# EAGLE design ob-xa-2p-lpf (EAGLE 9.5.1)
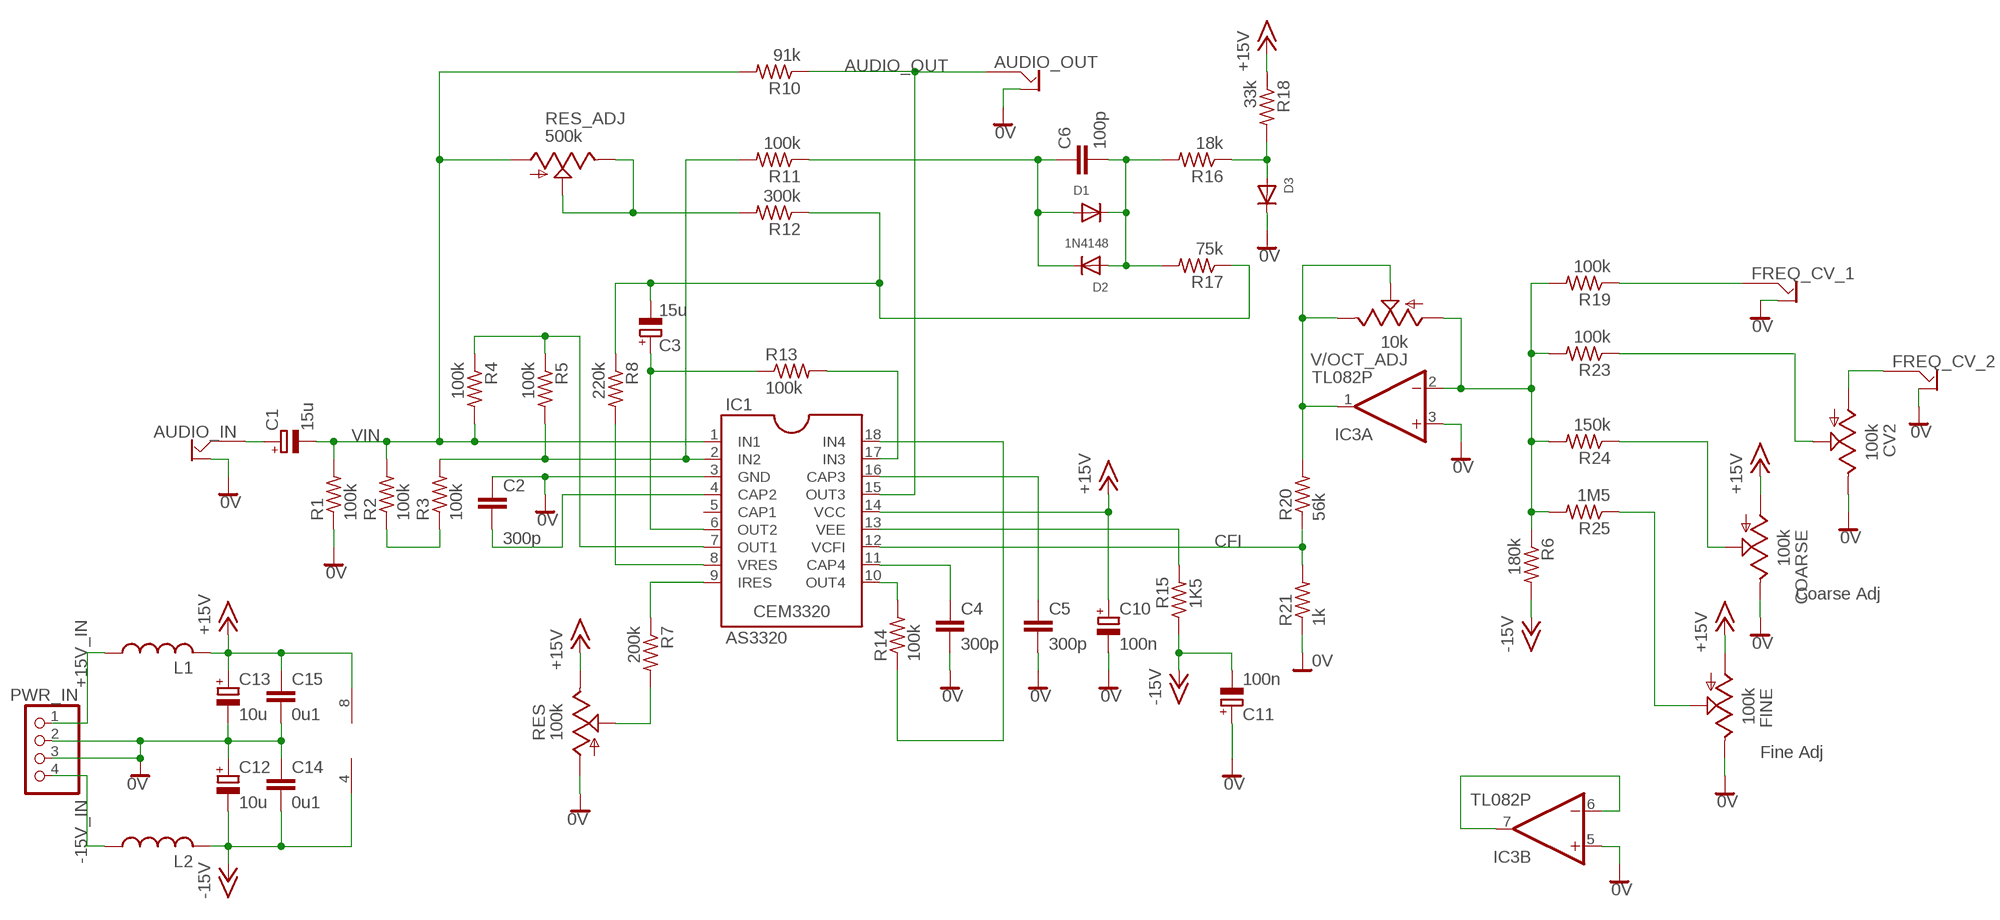
[diagram p0: schematic, sheet 1]

## Parts
AUDIO_IN  OFFBOARD2JACKALT  [OFFBOARD2JACKALT]
AUDIO_OUT  OFFBOARD2JACKALT  [OFFBOARD2JACKALT]
C1  15u  CPOL-EUE1.8-4  [E1,8-4]
C2  300p  C-EU050-025X075  [C050-025X075]
C3  15u  CPOL-EUE1.8-4  [E1,8-4]
C4  300p  C-EU050-025X075  [C050-025X075]
C5  300p  C-EU050-025X075  [C050-025X075]
C6  100p  C-EU050-025X075  [C050-025X075]
C10  100n  CPOL-EUE1.8-4  [E1,8-4]
C11  100n  CPOL-EUE1.8-4  [E1,8-4]
C12  10u  CPOL-EUE1.8-4  [E1,8-4]
C13  10u  CPOL-EUE1.8-4  [E1,8-4]
C14  0u1  C-EU050-025X075  [C050-025X075]
C15  0u1  C-EU050-025X075  [C050-025X075]
COARSE  100k  TRIM_US-B64Y  [B64Y]
CV2  100k  TRIM_US-B64Y  [B64Y]
D1  1N4148  DIODEDO-1N4148  [DO-1N4148]
D2  1N4148  DIODEDO-1N4148  [DO-1N4148]
D3  1N4148  DIODEDO-1N4148  [DO-1N4148]
FINE  100k  TRIM_US-B64Y  [B64Y]
FREQ_CV_1  OFFBOARD2JACKALT  [OFFBOARD2JACKALT]
FREQ_CV_2  OFFBOARD2JACKALT  [OFFBOARD2JACKALT]
IC1  AS3320  [DIL18]
IC3  TL082P  [DIL08]
L1  L-US0207/10  [0207/10]
L2  L-US0207/10  [0207/10]
PWR_IN  PINHD-1X4  [1X04]
R1  100k  R-US_0207/10  [0207/10]
R2  100k  R-US_0207/10  [0207/10]
R3  100k  R-US_0207/10  [0207/10]
R4  100k  R-US_0207/10  [0207/10]
R5  100k  R-US_0207/10  [0207/10]
R6  180k  R-US_0207/10  [0207/10]
R7  200k  R-US_0207/10  [0207/10]
R8  220k  R-US_0207/10  [0207/10]
R10  91k  R-US_0207/10  [0207/10]
R11  100k  R-US_0207/10  [0207/10]
R12  300k  R-US_0207/10  [0207/10]
R13  100k  R-US_0207/10  [0207/10]
R14  100k  R-US_0207/10  [0207/10]
R15  1K5  R-US_0207/10  [0207/10]
R16  18k  R-US_0207/10  [0207/10]
R17  75k  R-US_0207/10  [0207/10]
R18  33k  R-US_0207/10  [0207/10]
R19  100k  R-US_0207/10  [0207/10]
R20  56k  R-US_0207/10  [0207/10]
R21  1k  R-US_0207/10  [0207/10]
R23  100k  R-US_0207/10  [0207/10]
R24  150k  R-US_0207/10  [0207/10]
R25  1M5  R-US_0207/10  [0207/10]
RES  100k  TRIM_US-B64Y  [B64Y]
RES_ADJ  500k  TRIM_US-S63P  [S63P]
V/OCT_ADJ  10k  TRIM_US-S63P  [S63P]

## Nets
0V [Power]: AUDIO_IN.GND AUDIO_OUT.GND C2.1 C4.2 C5.2 C10.- C11.+ C12.+ C13.- C14.1 C15.2 COARSE.E CV2.E D3.C FINE.E FREQ_CV_1.GND FREQ_CV_2.GND IC1.3(GND) IC3.3(A:+IN) IC3.5(B:+IN) PWR_IN.2 PWR_IN.3 R1.1 R21.1 RES.A
+15V [Power]: C10.+ C13.+ C15.1 COARSE.A FINE.A IC1.14(VCC) IC3.8(P:V+) L1.2 R18.1 RES.E
+15V_IN [Power]: L1.1 PWR_IN.1
-15V [Power]: C11.- C12.- C14.2 IC3.4(P:V-) L2.2 R6.2 R15.1
-15V_IN [Power]: L2.1 PWR_IN.4
AUDIO_IN: AUDIO_IN.SIGNAL C1.+
AUDIO_OUT: AUDIO_OUT.SIGNAL IC1.15(OUT3) R10.1
CFI: IC1.12(VCFI) R20.1 R21.2
N$1: R2.1 R3.1
N$2: IC3.1(A:OUT) R20.2 V/OCT_ADJ.E V/OCT_ADJ.S
N$3: IC1.2(IN2) R3.2 R5.2 R11.2
N$4: C2.2 IC1.4(CAP2)
N$5: IC1.7(OUT1) R4.1 R5.1
N$6: C3.+ IC1.6(OUT2) R13.1
N$7: C6.1 D1.A D2.C R11.1
N$8: C6.2 D1.C D2.A R16.2 R17.2
N$9: D3.A R16.1 R18.2
N$10: IC1.17(IN3) R13.2
N$11: IC1.10(OUT4) R14.2
N$12: IC1.18(IN4) R14.1
N$13: IC1.8(VRES) R8.2
N$14: C3.- R8.1 R12.1 R17.1
N$15: R12.2 RES_ADJ.E RES_ADJ.S
N$16: IC1.13(VEE) R15.2
N$17: IC1.9(IRES) R7.1
N$18: C4.1 IC1.11(CAP4)
N$19: R7.2 RES.S
N$20: C5.1 IC1.16(CAP3)
N$22: IC3.6(B:-IN) IC3.7(B:OUT)
N$23: IC3.2(A:-IN) R6.1 R19.2 R23.2 R24.2 R25.2 V/OCT_ADJ.A
N$24: FREQ_CV_1.SIGNAL R19.1
N$25: CV2.S R23.1
N$26: CV2.A FREQ_CV_2.SIGNAL
N$27: COARSE.S R24.1
N$28: FINE.S R25.1
VIN: C1.- IC1.1(IN1) R1.2 R2.2 R4.2 R10.2 RES_ADJ.A
Unconnected: IC1.5(CAP1)

## Notes on the sheet
- Coarse Adj
- Fine Adj

## Library data of the parts
AUDIO_IN AUDIO_OUT FREQ_CV_1 FREQ_CV_2 = aarons_library:OFFBOARD2JACKALT
C1 C3 C10-C13 = rcl:CPOL-EU: POLARIZED CAPACITOR, European symbol; SPICEPREFIX: C
C2 C4-C6 C14 C15 = rcl:C-EU: CAPACITOR, European symbol; SPICEPREFIX: C
COARSE CV2 FINE RES RES_ADJ V/OCT_ADJ = pot:TRIM_US-: POTENTIOMETER
D1-D3 = adafruit:DIODE: Diode SMADIODE - SMA Surface Mount Package 20V 1A Schottky Diode Digikey: 641-1014-6-ND DO-1N4148 - Through Hole Small Current Diode SOD-123 20V 1 A (.5mV Vf) Schottky Diode - Digikey: MBRX120TPMSCT-ND SOD-323 10V 570mA (.38mV Vf, 3ns) Schottky Diode - Digikey: ZLLS410CT-ND SOD-523 30V 30mA Schottky Diode (RB751S-40TE61) - Digikey: RB751S-40TE61CT-ND SOT23-R/W - SOT23 Package (R = Solder Paste/Reflow Ovens, W = Hand-Soldering) BAT54Film 40V 300mA - Digikey: 497-7162-1-ND
IC1 = analog_audio:AS3320
IC3 = linear:TL082: OP AMP Data sheet <http://www.ti.com/lit/ds/symlink/tl084a . pdf>; DATA_SHEET: <a href="http://www.ti.com/lit/ds/symlink/tl084a.pdf"> Data sheet </a>
L1 L2 = rcl:L-US: INDUCTOR, American symbol; SPICEPREFIX: L
PWR_IN = pinhead:PINHD-1X4: PIN HEADER
R1-R8 R10-R21 R23-R25 = rcl:R-US_: RESISTOR, American symbol; SPICEPREFIX: R

## Net classes
0 default: width 0.406 mm
1 Power: width 0.762 mm

## Board
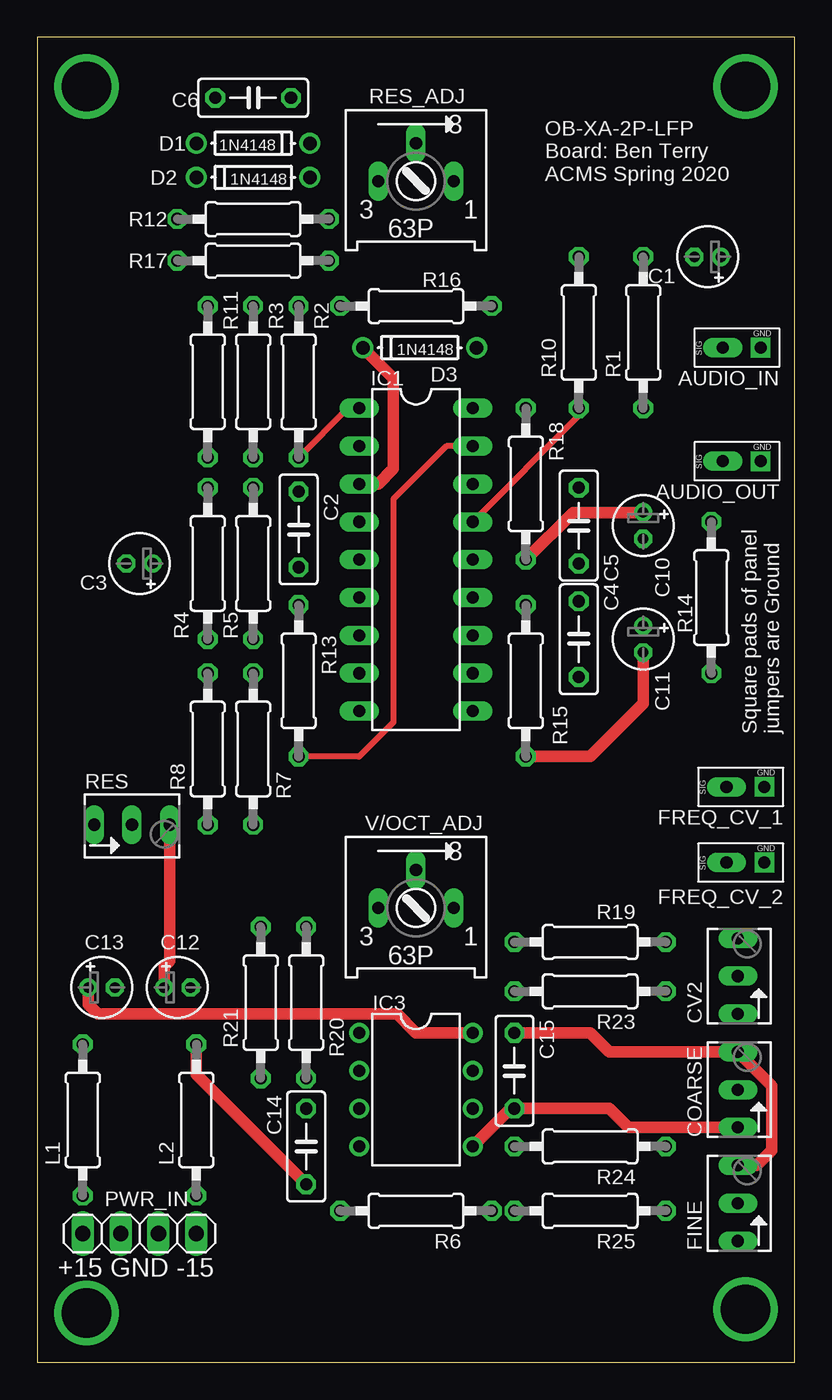
[diagram p1: board, top side]
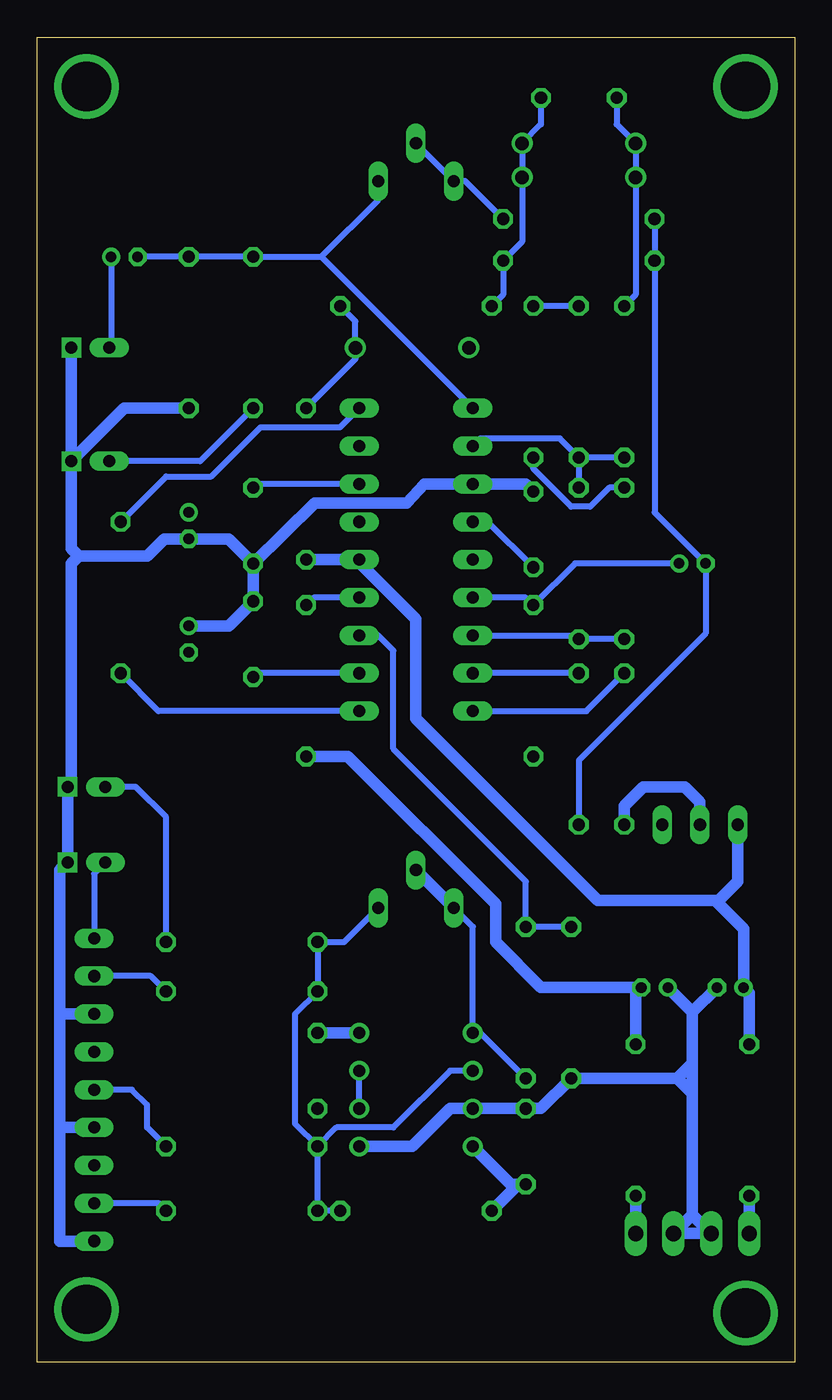
[diagram p2: board, bottom side, seen from below]

Size 50.8 x 88.9 mm. Coordinates in mm from the lower left corner, seen from the top.
Outline: 0,0 50.8,0 50.8,88.9 0,88.9 0,0
Copper layers (1*16): Top 0.035mm / dielectric 1.5mm / Bottom 0.035mm
Design rules "default": minimum track width 6mil, minimum drill 0.35mm, track to track 6mil, track to pad 6mil, pad to pad 6mil, via to via 6mil, smd to smd 6mil, copper to edge 40mil, drill to drill 6mil, minimum pad ring 10mil, minimum via ring 8mil, stop-mask expansion 4mil, vias tented up to drill 0mil, thermal gap 10mil

### Footprints (pad centres in the part's own frame; a part is rotated, then mirrored left to right if it is on the bottom)
OFFBOARD2JACKALT = drill 0.813 square: GND -1.27,-1.27 | drill 0.813 long: SIGNAL -1.27,1.27
E1,8-4 = drill 0.711 pad 1.168: + -0.889,0 | drill 0.711 pad 1.168 octagon: - 0.889,0
C050-025X075 = drill 0.813 octagon: 1 -2.54,0; 2 2.54,0
B64Y = drill 0.813 long: A 2.54,0; E -2.54,0; S 0,0
DO-1N4148 = drill 0.9: A -3.81,0; C 3.81,0
DIL18 = drill 0.813 long: 1 -10.16,-3.81; 2 -7.62,-3.81; 3 -5.08,-3.81; 4 -2.54,-3.81; 5 0,-3.81; 6 2.54,-3.81; 7 5.08,-3.81; 8 7.62,-3.81; 9 10.16,-3.81; 10 10.16,3.81; 11 7.62,3.81; 12 5.08,3.81; 13 2.54,3.81; 14 0,3.81; 15 -2.54,3.81; 16 -5.08,3.81; 17 -7.62,3.81; 18 -10.16,3.81
DIL08 = drill 0.813 pad 1.27: 1 -3.81,-3.81; 2 -1.27,-3.81; 3 1.27,-3.81; 4 3.81,-3.81; 5 3.81,3.81; 6 1.27,3.81; 7 -1.27,3.81; 8 -3.81,3.81
0207/10 = drill 0.813 octagon: 1 -5.08,0; 2 5.08,0
1X04 = drill 1.016 long: 1 -3.81,0; 2 -1.27,0; 3 1.27,0; 4 3.81,0
S63P = drill 0.813 long: A 2.54,0; E -2.54,0; S 0,2.54

### Placement (x,y rotation side)
AUDIO_IN  47.24,69.34 90 top
AUDIO_OUT  47.24,61.72 90 top
C1  44.96,74.17 180 top
C2  17.53,55.88 270 top
C3  6.86,53.59 180 top
C4  36.32,48.51 90 top
C5  36.32,56.13 270 top
C6  14.48,84.84 0 top
C10  40.64,56.13 270 top
C11  40.64,48.51 270 top
C12  9.4,25.15 0 top
C13  4.32,25.15 0 top
C14  18.03,14.48 270 top
C15  32,19.56 270 top
COARSE  46.99,18.29 90 top
CV2  46.99,25.91 90 top
D1  14.48,81.79 0 top
D2  14.48,79.5 180 top
D3  25.65,68.07 180 top
FINE  46.99,10.67 90 top
FREQ_CV_1  47.5,39.88 90 top
FREQ_CV_2  47.5,34.8 90 top
IC1  25.4,53.85 270 top
IC3  25.4,18.29 270 top
L1  3.05,16.26 90 top
L2  10.67,16.26 90 top
PWR_IN  6.86,8.64 0 top
R1  40.64,69.09 90 top
R2  17.53,65.79 270 top
R3  14.48,65.79 270 top
R4  11.43,53.59 90 top
R5  14.48,53.59 90 top
R6  25.4,10.16 180 top
R7  11.43,41.15 270 top
R8  14.48,41.15 90 top
R10  36.32,69.09 90 top
R11  11.43,65.79 270 top
R12  14.48,76.71 0 top
R13  17.53,45.72 270 top
R14  45.21,51.31 270 top
R15  32.77,45.72 90 top
R16  25.4,70.87 180 top
R17  14.48,73.91 0 top
R18  32.77,58.93 90 top
R19  37.08,28.19 180 top
R20  18.03,24.13 270 top
R21  14.99,24.13 90 top
R23  37.08,24.89 180 top
R24  37.08,14.48 180 top
R25  37.08,10.16 180 top
RES  6.35,36.07 0 top
RES_ADJ  25.4,79.25 0 top
V/OCT_ADJ  25.4,30.48 0 top

### Tracks (layer width: path | path; a pad name or v marks a point on that pad's centre or on a via)
0V
  Top 0.762: IC3.5 31.75,17.02 C15.2 38.35,17.02 39.62,15.75 COARSE.E | D3.C 23.88,66.04 23.88,59.94 22.86,58.93 IC1.3 | C12.+ 8.51,26.54 8.89,26.92 RES.A
  Bottom 0.762: C2.1 18.03,58.93 IC1.3 24.83,58.93 26.02,57.66 32.18,57.66 C5.2 | IC3.5 25.65,14.48 23.11,17.02 IC3.3 C14.1 17.02,17.02 R21.1 7.87,19.05 | C5.2 C4.2 37.97,49.4 C11.+ | C5.2 37.97,55.24 C10.- 42.29,55.24 43.43,54.1 48.01,54.1 | 49.28,23.37 49.28,33.02 FREQ_CV_2.GND FREQ_CV_1.GND 48.51,38.86 48.51,53.59 48.01,54.1 | 49.28,23.37 CV2.E | 49.28,23.37 49.28,15.75 | 49.28,15.75 COARSE.E | 49.28,15.75 49.28,8.13 FINE.E | AUDIO_OUT.GND AUDIO_IN.GND | R1.1 44.96,64.01 AUDIO_OUT.GND | AUDIO_OUT.GND 48.51,54.61 48.01,54.1 | 6.86,9.91 PWR_IN.3 PWR_IN.2 6.86,9.91 | C13.- 6.86,23.5 | 6.86,23.5 6.86,20.07 | 6.86,20.07 6.86,18.03 | 6.86,18.03 6.86,9.91 | C12.+ 6.86,23.5 | 7.87,19.05 6.86,18.03 | 7.87,19.05 6.86,20.07
+15V
  Top 0.762: C15.1 37.08,22.1 38.35,20.83 COARSE.A 49.28,18.54 49.28,14.22 48.26,13.21 FINE.A | R18.1 35.94,57.02 C10.+ | IC3.8 25.4,22.1 24.13,23.37 4.06,23.37 3.43,24 C13.+
  Bottom 0.762: R18.1 IC1.14 29.21,53.66 25.43,49.87 25.43,43.2 13.21,30.99 5.33,30.99 | IC3.8 C15.1 | L1.2 3.05,24.77 C13.+ 3.43,29.08 5.33,30.99 | 5.33,30.99 5.08,30.99 3.81,32.26 RES.E
+15V_IN
  Bottom 0.762: PWR_IN.1 L1.1
-15V
  Top 0.762: L2.2 10.67,19.3 C14.2 | R15.1 37.08,40.64 40.64,44.2 C11.-
  Bottom 0.762: IC3.4 19.05,11.94 C14.2 18.54,11.94 R6.2 | L2.2 10.67,24.77 C12.- 17.02,25.15 20.07,28.19 20.07,30.73 29.97,40.64 R15.1
-15V_IN
  Bottom 0.762: PWR_IN.4 L2.1
AUDIO_IN
  Bottom 0.406: C1.+ 45.85,68.2 AUDIO_IN.SIGNAL
AUDIO_OUT
  Top 0.406: IC1.15 36.32,63.5 R10.1
  Bottom 0.406: R10.1 39.88,60.45 AUDIO_OUT.SIGNAL
CFI
  Bottom 0.406: R21.2 R20.1 18.03,32.26 26.92,41.15 26.92,47.75 27.94,48.77 IC1.12
N$1
  Bottom 0.406: R3.1 R2.1
N$2
  Bottom 0.406: R20.2 21.08,22.1 IC3.1 21.59,29.21 V/OCT_ADJ.E
  Bottom 0.762: V/OCT_ADJ.E V/OCT_ADJ.S
N$3
  Bottom 0.406: R11.2 R3.2 | R3.2 R5.2 | R3.2 15.75,61.98 21.08,61.98 IC1.2
N$4
  Bottom 0.406: C2.2 20.57,56.39 IC1.4
N$5
  Bottom 0.406: R4.1 14.22,48.51 | 14.22,48.51 R5.1 | 14.22,48.51 14.48,48.77 IC1.7
N$6
  Bottom 0.406: C3.+ 14.73,53.59 R13.1 18.03,51.31 IC1.6
N$7
  Bottom 0.406: C6.1 11.94,83.06 D1.A D2.C 10.67,71.63 R11.1
N$8
  Bottom 0.406: C6.2 17.02,83.06 D1.C D2.A 18.29,75.18 R17.2 19.56,71.63 R16.2
N$9
  Bottom 0.406: R16.1 29.46,69.85 D3.A 29.46,67.31 R18.2
N$10
  Top 0.406: IC1.17 27.43,61.47 23.88,57.91 23.88,42.93 21.59,40.64 R13.2
N$11
  Bottom 0.406: IC1.10 42.67,43.69 R14.2
N$12
  Bottom 0.406: R14.1 42.16,59.44 39.12,59.44 35.81,62.74 30.48,62.74 IC1.18
N$13
  Bottom 0.406: R8.2 IC1.8
N$14
  Bottom 0.406: R12.1 R17.1 9.4,57.02 C3.- 5.97,48.9 14.48,40.39 R8.1
N$15
  Bottom 0.406: R12.2 22.1,79.25 RES_ADJ.E RES_ADJ.S
N$16
  Bottom 0.406: IC1.13 32.26,51.31 R15.2
N$17
  Bottom 0.406: IC1.9 13.97,43.69 R7.1
N$18
  Bottom 0.406: IC1.11 36.07,46.23 C4.1
N$19
  Bottom 0.762: RES.S 6.35,37.59 7.37,38.61 10.16,38.61 11.43,37.34 R7.2
N$20
  Bottom 0.406: IC1.16 36.07,58.93 C5.1
N$21  (via drill 3.3)
  other vias: 3.3,85.6
N$22
  Bottom 0.406: IC3.6 IC3.7
N$23
  Bottom 0.406: R6.1 R25.2 R24.2 | IC3.2 23.11,19.56 26.92,15.75 30.73,15.75 R24.2 | V/OCT_ADJ.A 30.23,28.19 R19.2 R23.2 33.53,23.37 33.53,16 R24.2
N$24
  Bottom 0.406: FREQ_CV_1.SIGNAL 44.2,38.61 42.16,36.58 R19.1
N$25
  Bottom 0.406: R23.1 43.18,25.91 CV2.S
N$26
  Bottom 0.406: FREQ_CV_2.SIGNAL 46.99,32.77 CV2.A
N$27
  Bottom 0.406: R24.1 43.43,15.75 43.43,17.27 44.45,18.29 COARSE.S
N$28
  Bottom 0.406: R25.1 42.67,10.67 FINE.S
N$29  (via drill 3.3)
  other vias: 47.5,85.6
N$30  (via drill 3.3)
  other vias: 47.5,3.56
N$31  (via drill 3.3)
  other vias: 3.3,3.3
VIN
  Top 0.406: R2.2 20.83,64.01 IC1.1
  Bottom 0.406: R4.2 12.45,58.67 13.72,57.4 14.99,57.4 17.53,59.94 R2.2 | 31.75,74.17 R10.2 R1.2 C1.- | 31.75,74.17 IC1.1 | 31.75,74.17 27.94,77.98 RES_ADJ.A

### Text on the board
tNames: OB-XA-2P-LFP / Board: Ben Terry / ACMS Spring 2020 | Square pads of panel / jumpers are Ground | +15 GND -15